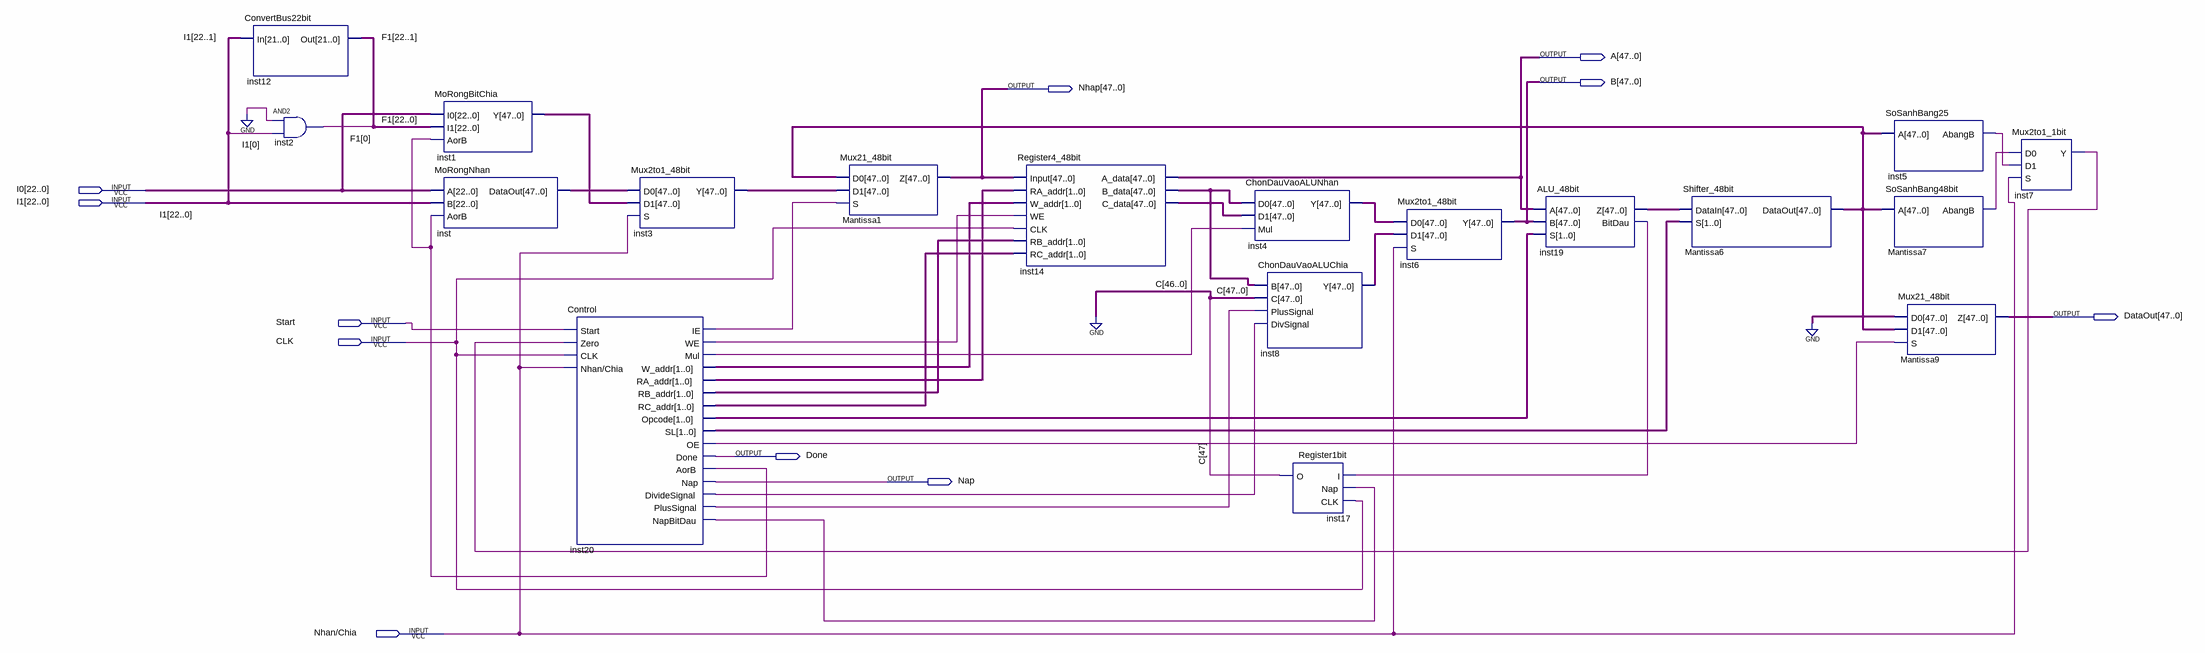
[diagram p0: schematic sheet]
// Quartus schematic Mantissa.bdf as structural Verilog: 18 symbols, 11 pins
module Mantissa (
  input  [22:0] I0,
  input  [22:0] I1,
  input  Start,
  input  CLK,
  input  \Nhan/Chia ,
  output [47:0] A,
  output [47:0] B,
  output [47:0] Nhap,
  output [47:0] DataOut,
  output Done,
  output Nap
);

  wire inst5_abangb, inst7_y, inst19_bitdau, inst20_aorb, inst20_dividesignal, inst20_ie, inst20_mul,
       inst20_napbitdau, inst20_oe, inst20_plussignal, inst20_we, Mantissa7_abangb;
  wire [1:0] inst20_opcode, inst20_ra_addr, inst20_rb_addr, inst20_rc_addr, inst20_sl, inst20_w_addr;
  wire [22:0] F1;
  wire [47:0] inst1_y, inst3_y, inst4_y, inst8_y, inst14_b_data, inst14_c_data, inst19_z, inst_dataout,
       Mantissa6_dataout;
  wire [47:47] C;

  ConvertBus22bit inst12 (.In(I1[22:1]), .Out(F1[22:1]));
  and inst2 (F1[0], 1'b0, I1[0]);
  MoRongBitChia inst1 (.I0(I0), .I1(F1), .AorB(inst20_aorb), .Y(inst1_y));
  MoRongNhan inst (.A(I0), .B(I1), .AorB(inst20_aorb), .DataOut(inst_dataout));
  Control inst20 (
    .Start(Start), .Zero(inst7_y), .CLK(CLK), .\Nhan/Chia (\Nhan/Chia ), .WE(inst20_we),
    .NapBitDau(inst20_napbitdau), .PlusSignal(inst20_plussignal), .DivideSignal(inst20_dividesignal),
    .AorB(inst20_aorb), .IE(inst20_ie), .W_addr(inst20_w_addr), .RA_addr(inst20_ra_addr),
    .RB_addr(inst20_rb_addr), .RC_addr(inst20_rc_addr), .Opcode(inst20_opcode), .SL(inst20_sl),
    .OE(inst20_oe), .Mul(inst20_mul), .Nap(Nap), .Done(Done));
  Mux2to1_48bit inst3 (.D0(inst_dataout), .D1(inst1_y), .S(\Nhan/Chia ), .Y(inst3_y));
  Mux21_48bit Mantissa1 (.D0(Mantissa6_dataout), .D1(inst3_y), .S(inst20_ie), .Z(Nhap));
  Register4_48bit inst14 (
    .Input(Nhap), .RA_addr(inst20_ra_addr), .W_addr(inst20_w_addr), .WE(inst20_we), .CLK(CLK),
    .RB_addr(inst20_rb_addr), .RC_addr(inst20_rc_addr), .A_data(A), .B_data(inst14_b_data),
    .C_data(inst14_c_data));
  ChonDauVaoALUNhan inst4 (.D0(inst14_b_data), .D1(inst14_c_data), .Mul(inst20_mul), .Y(inst4_y));
  ChonDauVaoALUChia inst8 (
    .B(inst14_b_data), .C({C[47], {47{1'b0}}}), .PlusSignal(inst20_plussignal),
    .DivSignal(inst20_dividesignal), .Y(inst8_y));
  Register1bit inst17 (.I(inst19_bitdau), .Nap(inst20_napbitdau), .CLK(CLK), .O(C[47]));
  Mux2to1_48bit inst6 (.D0(inst4_y), .D1(inst8_y), .S(\Nhan/Chia ), .Y(B));
  ALU_48bit inst19 (.A(A), .B(B), .S(inst20_opcode), .Z(inst19_z), .BitDau(inst19_bitdau));
  Shifter_48bit Mantissa6 (.DataIn(inst19_z), .S(inst20_sl), .DataOut(Mantissa6_dataout));
  SoSanhBang25 inst5 (.A(Mantissa6_dataout), .AbangB(inst5_abangb));
  SoSanhBang48bit Mantissa7 (.A(Mantissa6_dataout), .AbangB(Mantissa7_abangb));
  Mux21_48bit Mantissa9 (.D0({48{1'b0}}), .D1(Mantissa6_dataout), .S(inst20_oe), .Z(DataOut));
  Mux2to1_1bit inst7 (.D0(Mantissa7_abangb), .D1(inst5_abangb), .S(\Nhan/Chia ), .Y(inst7_y));
endmodule
